# EAGLE design Location_controller (EAGLE 6.5.0)
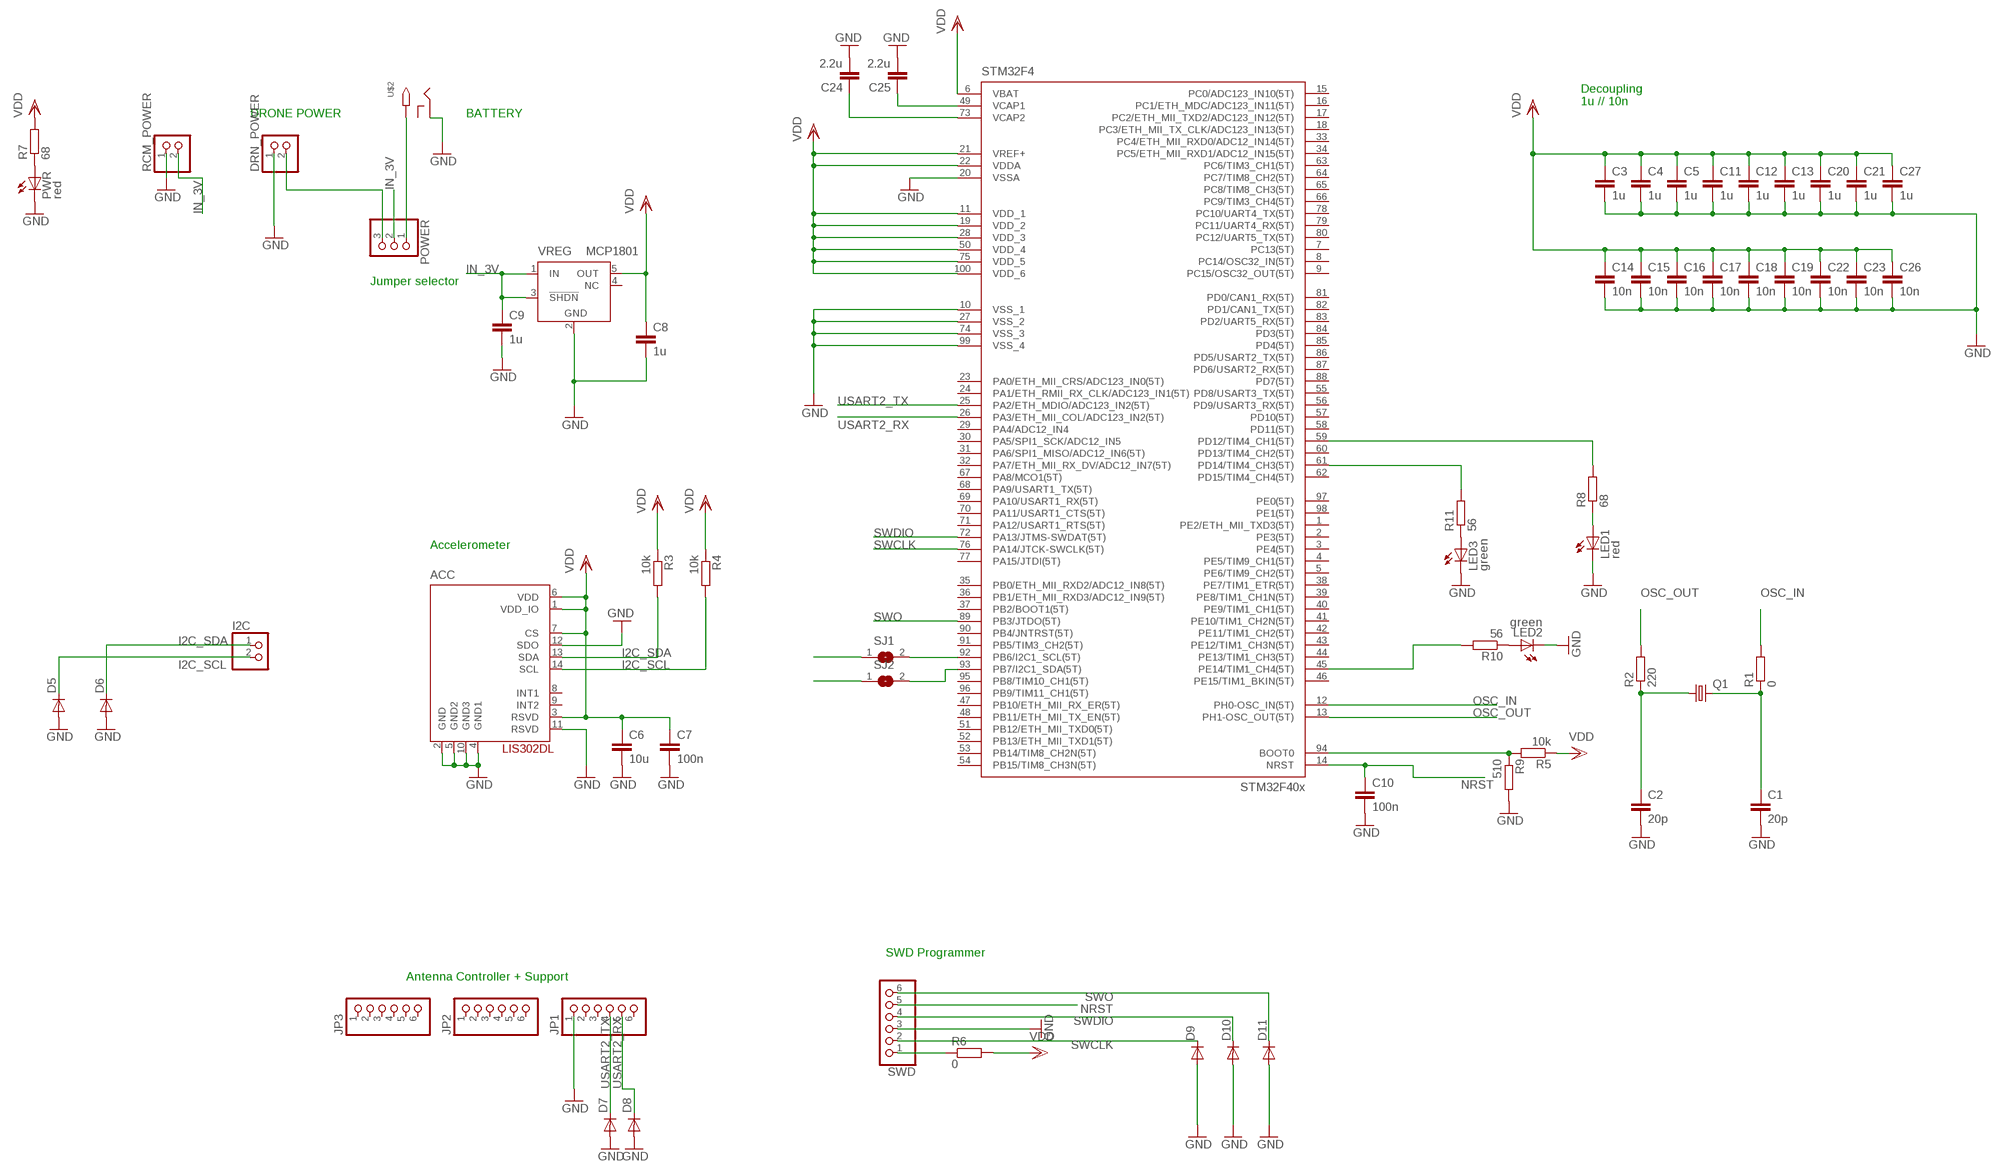
[diagram p0: schematic, sheet 1]

## Parts
ACC  LIS302DL  LSM303DLHC  [LGA-14]
C1  20p  C  [C0805]
C2  20p  C  [C0805]
C3  1u  C  [C0805]
C4  1u  C  [C0805]
C5  1u  C  [C0805]
C6  10u  C  [C0805]
C7  100n  C  [C0805]
C8  1u  C  [C0805]
C9  1u  C  [C0805]
C10  100n  C  [C0805]
C11  1u  C  [C0805]
C12  1u  C  [C0805]
C13  1u  C  [C0805]
C14  10n  C  [C0805]
C15  10n  C  [C0805]
C16  10n  C  [C0805]
C17  10n  C  [C0805]
C18  10n  C  [C0805]
C19  10n  C  [C0805]
C20  1u  C  [C0805]
C21  1u  C  [C0805]
C22  10n  C  [C0805]
C23  10n  C  [C0805]
C24  2.2u  C  [C0805]
C25  2.2u  C  [C0805]
C26  10n  C  [C0805]
C27  1u  C  [C0805]
D5  DIODE-SOD523  [SOD523]
D6  DIODE-SOD523  [SOD523]
D7  DIODE-SOD523  [SOD523]
D8  DIODE-SOD523  [SOD523]
D9  DIODE-SOD523  [SOD523]
D10  DIODE-SOD523  [SOD523]
D11  DIODE-SOD523  [SOD523]
DRN_POWER  PINHD-1X2  [1X02]
I2C  PINHD-1X2  [1X02]
JP1  PINHD-1X6  [1X06]
JP2  PINHD-1X6  [1X06]
JP3  PINHD-1X6  [1X06]
LED1  red  LEDCHIPLED_0805  [CHIPLED_0805]
LED2  green  LEDCHIPLED_0805  [CHIPLED_0805]
LED3  green  LEDCHIPLED_0805  [CHIPLED_0805]
POWER  PINHD-1X3  [1X03]
PWR  red  LEDCHIPLED_0805  [CHIPLED_0805]
Q1  CRYSTALHC49S  [HC49/S]
R1  0  R  [R0805]
R2  220  R  [R0805]
R3  10k  R  [R0805]
R4  10k  R  [R0805]
R5  10k  R  [R0805]
R6  0  R  [R0805]
R7  68  R  [R0805]
R8  68  R  [R0805]
R9  510  R  [R0805]
R10  56  R  [R0805]
R11  56  R  [R0805]
RCM_POWER  PINHD-1X2  [1X02]
SJ1  SJ  [SJ]
SJ2  SJ  [SJ]
STM32F4  STM32F407V  [TQFP100]
SWD  PINHD-1X6  [1X06]
U$2  2.1MMJACKTHM  [PJ-102A]
VREG  MCP1801  [SOT23-5]

## Nets
GND: ACC.2(GND) ACC.4(GND1) ACC.5(GND2) ACC.10(GND3) ACC.11(RSVD) ACC.12(SDO) C1.2 C2.2 C3.2 C4.2 C5.2 C6.2 C7.2 C8.2 C9.2 C10.2 C11.2 C12.2 C13.2 C14.2 C15.2 C16.2 C17.2 C18.2 C19.2 C20.2 C21.2 C22.2 C23.2 C24.2 C25.2 C26.2 C27.2 D5.A D6.A D7.A D8.A D9.A D10.A D11.A DRN_POWER.1 JP1.1 LED1.C LED2.C LED3.C PWR.C R9.2 RCM_POWER.1 STM32F4.10(VSS_1) STM32F4.20(VSSA) STM32F4.27(VSS_2) STM32F4.74(VSS_3) STM32F4.99(VSS_4) SWD.3 U$2.RING VREG.2(GND)
I2C_SCL: ACC.14(SCL) D5.C I2C.2 R4.2 SJ1.1
I2C_SDA: ACC.13(SDA) D6.C I2C.1 R3.2 SJ2.1
IN_3V: C9.1 POWER.2 RCM_POWER.2 VREG.1(IN) VREG.3(!SHDN)
N$1: C2.1 Q1.1 R2.1
N$2: C1.1 Q1.2 R1.1
N$3: R5.2 R9.1 STM32F4.94(BOOT0)
N$4: DRN_POWER.2 POWER.3
N$5: POWER.1 U$2.TIP
N$6: R6.1 SWD.1
N$8: C25.1 STM32F4.49(VCAP1)
N$9: C24.1 STM32F4.73(VCAP2)
N$12: PWR.A R7.1
N$13: LED1.A R8.1
N$14: R8.2 STM32F4.59(PD12/TIM4_CH1(5T))
N$15: LED2.A R10.1
N$16: R10.2 STM32F4.45(PE14/TIM1_CH4(5T))
N$17: LED3.A R11.1
N$18: SJ2.2 STM32F4.93(PB7/I2C1_SDA(5T))
N$19: R11.2 STM32F4.61(PD14/TIM4_CH3(5T))
N$20: SJ1.2 STM32F4.92(PB6/I2C1_SCL(5T))
NRST: C10.1 STM32F4.14(NRST) SWD.5
OSC_IN: R1.2 STM32F4.12(PH0-OSC_IN(5T))
OSC_OUT: R2.2 STM32F4.13(PH1-OSC_OUT(5T))
SWCLK: D9.C STM32F4.76(PA14/JTCK-SWCLK(5T)) SWD.2
SWDIO: D10.C STM32F4.72(PA13/JTMS-SWDAT(5T)) SWD.4
SWO: D11.C STM32F4.89(PB3/JTDO(5T)) SWD.6
USART2_RX: D8.C JP1.5 STM32F4.26(PA3/ETH_MII_COL/ADC123_IN2(5T))
USART2_TX: D7.C JP1.4 STM32F4.25(PA2/ETH_MDIO/ADC123_IN2(5T))
VDD: ACC.1(VDD_IO) ACC.3(RSVD) ACC.6(VDD) ACC.7(CS) C3.1 C4.1 C5.1 C6.1 C7.1 C8.1 C11.1 C12.1 C13.1 C14.1 C15.1 C16.1 C17.1 C18.1 C19.1 C20.1 C21.1 C22.1 C23.1 C26.1 C27.1 R3.1 R4.1 R5.1 R6.2 R7.2 STM32F4.6(VBAT) STM32F4.11(VDD_1) STM32F4.19(VDD_2) STM32F4.21(VREF+) STM32F4.22(VDDA) STM32F4.28(VDD_3) STM32F4.50(VDD_4) STM32F4.75(VDD_5) STM32F4.100(VDD_6) VREG.5(OUT)
Unconnected: ACC.8(INT1) ACC.9(INT2) JP1.2 JP1.3 JP1.6 JP2.1 JP2.2 JP2.3 JP2.4 JP2.5 JP2.6 JP3.1 JP3.2 JP3.3 JP3.4 JP3.5 JP3.6 STM32F4.1(PE2/ETH_MII_TXD3(5T)) STM32F4.2(PE3(5T)) STM32F4.3(PE4(5T)) STM32F4.4(PE5/TIM9_CH1(5T)) STM32F4.5(PE6/TIM9_CH2(5T)) STM32F4.7(PC13(5T)) STM32F4.8(PC14/OSC32_IN(5T)) STM32F4.9(PC15/OSC32_OUT(5T)) STM32F4.15(PC0/ADC123_IN10(5T)) STM32F4.16(PC1/ETH_MDC/ADC123_IN11(5T)) STM32F4.17(PC2/ETH_MII_TXD2/ADC123_IN12(5T)) STM32F4.18(PC3/ETH_MII_TX_CLK/ADC123_IN13(5T)) STM32F4.23(PA0/ETH_MII_CRS/ADC123_IN0(5T)) STM32F4.24(PA1/ETH_RMII_RX_CLK/ADC123_IN1(5T)) STM32F4.29(PA4/ADC12_IN4) STM32F4.30(PA5/SPI1_SCK/ADC12_IN5) STM32F4.31(PA6/SPI1_MISO/ADC12_IN6(5T)) STM32F4.32(PA7/ETH_MII_RX_DV/ADC12_IN7(5T)) STM32F4.33(PC4/ETH_MII_RXD0/ADC12_IN14(5T)) STM32F4.34(PC5/ETH_MII_RXD1/ADC12_IN15(5T)) STM32F4.35(PB0/ETH_MII_RXD2/ADC12_IN8(5T)) STM32F4.36(PB1/ETH_MII_RXD3/ADC12_IN9(5T)) STM32F4.37(PB2/BOOT1(5T)) STM32F4.38(PE7/TIM1_ETR(5T)) STM32F4.39(PE8/TIM1_CH1N(5T)) STM32F4.40(PE9/TIM1_CH1(5T)) STM32F4.41(PE10/TIM1_CH2N(5T)) STM32F4.42(PE11/TIM1_CH2(5T)) STM32F4.43(PE12/TIM1_CH3N(5T)) STM32F4.44(PE13/TIM1_CH3(5T)) STM32F4.46(PE15/TIM1_BKIN(5T)) STM32F4.47(PB10/ETH_MII_RX_ER(5T)) STM32F4.48(PB11/ETH_MII_TX_EN(5T)) STM32F4.51(PB12/ETH_MII_TXD0(5T)) STM32F4.52(PB13/ETH_MII_TXD1(5T)) STM32F4.53(PB14/TIM8_CH2N(5T)) STM32F4.54(PB15/TIM8_CH3N(5T)) STM32F4.55(PD8/USART3_TX(5T)) STM32F4.56(PD9/USART3_RX(5T)) STM32F4.57(PD10(5T)) STM32F4.58(PD11(5T)) STM32F4.60(PD13/TIM4_CH2(5T)) STM32F4.62(PD15/TIM4_CH4(5T)) STM32F4.63(PC6/TIM3_CH1(5T)) STM32F4.64(PC7/TIM8_CH2(5T)) STM32F4.65(PC8/TIM8_CH3(5T)) STM32F4.66(PC9/TIM3_CH4(5T)) STM32F4.67(PA8/MCO1(5T)) STM32F4.68(PA9/USART1_TX(5T)) STM32F4.69(PA10/USART1_RX(5T)) STM32F4.70(PA11/USART1_CTS(5T)) STM32F4.71(PA12/USART1_RTS(5T)) STM32F4.77(PA15/JTDI(5T)) STM32F4.78(PC10/UART4_TX(5T)) STM32F4.79(PC11/UART4_RX(5T)) STM32F4.80(PC12/UART5_TX(5T)) STM32F4.81(PD0/CAN1_RX(5T)) STM32F4.82(PD1/CAN1_TX(5T)) STM32F4.83(PD2/UART5_RX(5T)) STM32F4.84(PD3(5T)) STM32F4.85(PD4(5T)) STM32F4.86(PD5/USART2_TX(5T)) STM32F4.87(PD6/USART2_RX(5T)) STM32F4.88(PD7(5T)) STM32F4.90(PB4/JNTRST(5T)) STM32F4.91(PB5/TIM3_CH2(5T)) STM32F4.95(PB8/TIM10_CH1(5T)) STM32F4.96(PB9/TIM11_CH1(5T)) STM32F4.97(PE0(5T)) STM32F4.98(PE1(5T)) U$2.RING_SW VREG.4(NC)

## Notes on the sheet
- Decoupling
  1u // 10n
- DRONE POWER | BATTERY
- Jumper selector
- Accelerometer
- SWD Programmer
- Antenna Controller + Support

## Library data of the parts
ACC = stm32f4:LSM303DLHC: Ultra compact high performance e-compass, 3D accelerometer and 3D magnetometer module LIS302DL
C1-C27 = eagle-ltspice:C: CAPACITOR, European symbol; SPICEMODEL: NONE; SPICEPREFIX: C
D5-D11 = diode:DIODE-: DIODE
DRN_POWER I2C RCM_POWER = pinhead:PINHD-1X2: PIN HEADER
JP1-JP3 SWD = pinhead:PINHD-1X6: PIN HEADER
LED1-LED3 PWR = led:LED: LED OSRAM: - CHIPLED LG R971, LG N971, LY N971, LG Q971, LY Q971, LO R971, LY R971 LH N974, LH R974 LS Q976, LO Q976, LY Q976 LO Q996 - Hyper CHIPLED LW Q18S LB Q993, LB Q99A, LB R99A - SideLED LS A670, LO A670, LY A670, LG A670, LP A670 LB A673, LV A673, LT A673, LW A673 LH A674 LY A675 LS A676, LA A676, LO A676, LY A676, LW A676 LS A679, LY A679, LG A679 - Hyper Micro SIDELED® LS Y876, LA Y876, LO Y876, LY Y876 LT Y87S - SmartLED LW L88C, LW L88S LB L89C, LB L89S, LG L890 LS L89K, LO L89K, LY L89K LS L896, LA L896, LO L896, LY L896 - TOPLED LS T670, LO T670, LY T670, LG T670, LP T670 LSG T670, LSP T670, LSY T670, LOP T670, LYG T670 LG T671, LOG T671, LSG T671 LB T673, LV T673, LT T673, LW T673 LH T674 LS T676, LA T676, LO T676, LY T676, LB T676, LH T676, LSB T676, LW T676 LB T67C, LV T67C, LT T67C, LS T67K, LO T67K, LY T67K, LW E67C LS E67B, LA E67B, LO E67B, LY E67B, LB E67C, LV E67C, LT E67C LW T67C LS T679, LY T679, LG T679 LS T770, LO T770, LY T770, LG T770, LP T770 LB T773, LV T773, LT T773, LW T773 LH T774 LS E675, LA E675, LY E675, LS T675 LS T776, LA T776, LO T776, LY T776, LB T776 LHGB T686 LT T68C, LB T68C - Hyper Mini TOPLED® LB M676 - Mini TOPLED Santana® LG M470 LS M47K, LO M47K, LY M47K Source: http://www.osram.convergy.de LUXEON: - LUMILED® LXK2-PW12-R00, LXK2-PW12-S00, LXK2-PW14-U00, LXK2-PW14-V00 LXK2-PM12-R00, LXK2-PM12-S00, LXK2-PM14-U00 LXK2-PE12-Q00, LXK2-PE12-R00, LXK2-PE12-S00, LXK2-PE14-T00, LXK2-PE14-U00 LXK2-PB12-K00, LXK2-PB12-L00, LXK2-PB12-M00, LXK2-PB14-N00, LXK2-PB14-P00, LXK2-PB14-Q00 LXK2-PR12-L00, LXK2-PR12-M00, LXK2-PR14-Q00, LXK2-PR14-R00 LXK2-PD12-Q00, LXK2-PD12-R00, LXK2-PD12-S00 LXK2-PH12-R00, LXK2-PH12-S00 LXK2-PL12-P00, LXK2-PL12-Q00, LXK2-PL12-R00 Source: www.luxeon.com KINGBRIGHT: KA-3528ASYC Source: www.kingbright.com
POWER = pinhead:PINHD-1X3: PIN HEADER
Q1 = crystal:CRYSTAL: CRYSTAL; OC_FARNELL: 1667008; OC_NEWARK: unknown
R1-R11 = eagle-ltspice:R: RESISTOR, European symbol; SPICEMODEL: NONE; SPICEPREFIX: R
SJ1 SJ2 = jumper:SJ: SMD solder JUMPER
STM32F4 = stm32f4:STM32F407V: STM32F407 100 pin LQFP reviewed: YES tested: YES
U$2 = adafruit:2.1MMJACK: 2.1mm x 5.5mm THM DC jack with internal switch. Digikey part #PJ-102A, 4UCON part #05537 2.1mm x 5.5mm SMT DC jack with internal switch. Digikey part #PJ-002A-SMT, 4UCON part #03267 By microbuilder.eu & adafruit.com
VREG = stm32f4:MCP1801: MCP1801 150 mA, LDO Voltage Regulator

## Board
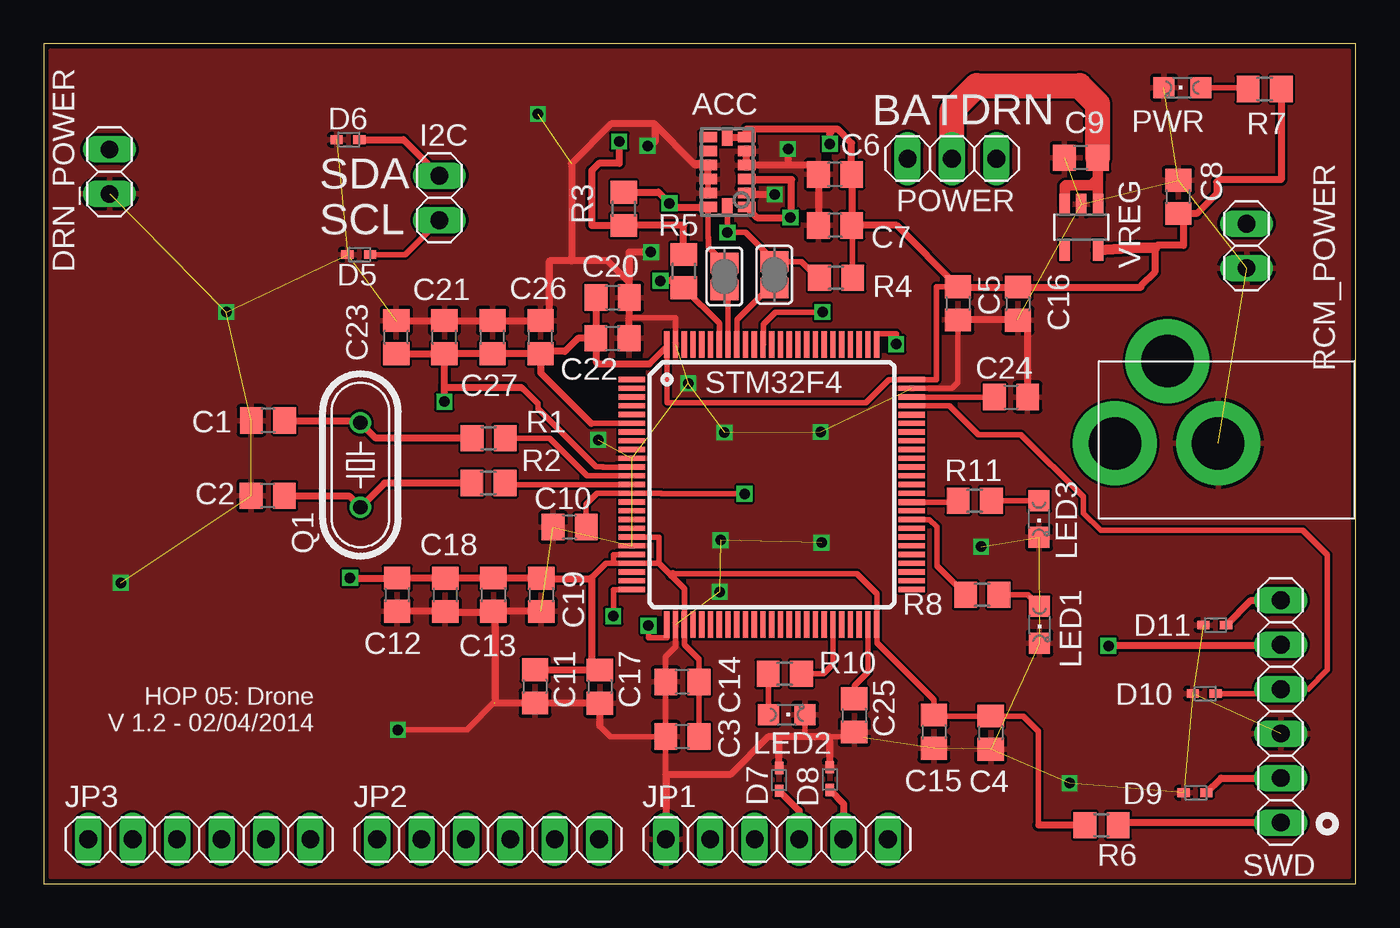
[diagram p1: board, top side]
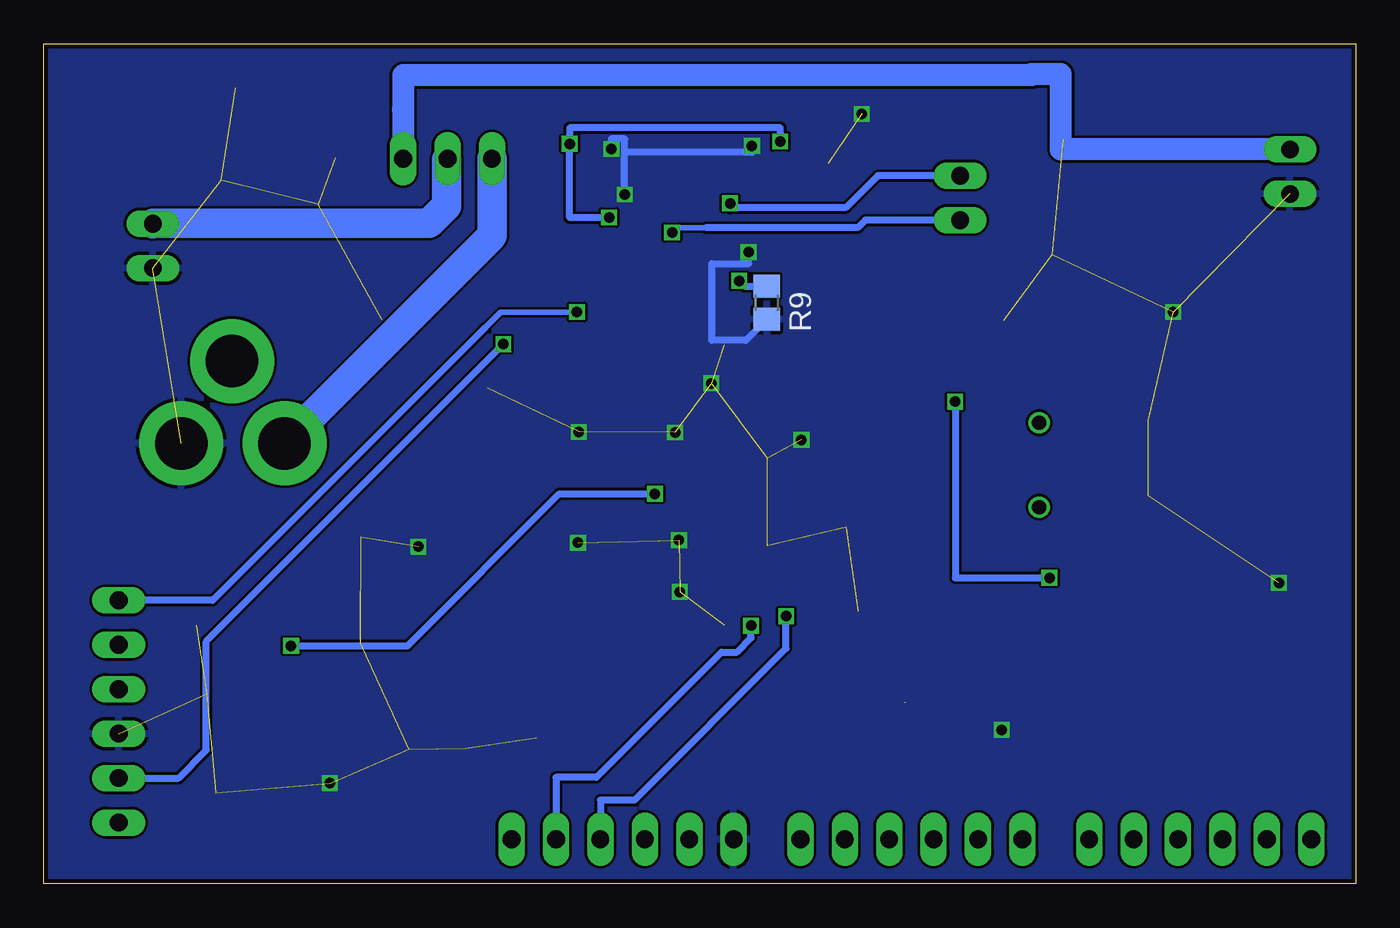
[diagram p2: board, bottom side, seen from below]

Size 75 x 48 mm. Coordinates in mm from the lower left corner, seen from the top.
Outline: 0,0 75,0 75,48 0,48 0,0
Copper layers (1*16): Top 0.018mm / dielectric 1.55mm / Bottom 0.018mm
Design rules "eC_2Layer_PClass6_BaseCopperO18_eCDefault": minimum track width 0.15mm, minimum drill 0.35mm, track to track 0.15mm, track to pad 0.15mm, pad to pad 0.15mm, via to via 0.15mm, smd to smd 0mil, copper to edge 0.25mm, drill to drill 0.35mm, minimum pad ring 0.175mm, minimum via ring 0.125mm, stop-mask expansion 0mil, vias tented up to drill 0.45mm, thermal gap 0.2mm

### Footprints (pad centres in the part's own frame; a part is rotated, then mirrored left to right if it is on the bottom)
LGA-14 = smd 0.6 x 1: 1 -2,-1.1; 2 -1.2,-1.1; 3 -0.4,-1.1; 4 0.4,-1.1; 5 1.2,-1.1; 6 2,-1.1; 8 2,1.1; 9 1.2,1.1; 10 0.4,1.1; 11 -0.4,1.1; 12 -1.2,1.1; 13 -2,1.1 | smd 1 x 0.6: 7 2,0; 14 -2,0
C0805 = smd 1.3 x 1.5: 1 -0.95,0; 2 0.95,0
SOD523 = smd 0.7 x 0.5: A 0.7,0; C -0.6,0
1X02 = drill 1.016 long: 1 -1.27,0; 2 1.27,0
1X06 = drill 1.016 long: 1 -6.35,0; 2 -3.81,0; 3 -1.27,0; 4 1.27,0; 5 3.81,0; 6 6.35,0
CHIPLED_0805 = smd 1.2 x 1.2: A 0,-1.05; C 0,1.05
1X03 = drill 1.016 long: 1 -2.54,0; 2 0,0; 3 2.54,0
HC49/S = drill 0.813: 1 -2.413,0; 2 2.413,0
R0805 = smd 1.3 x 1.5: 1 -0.95,0; 2 0.95,0
SJ = smd 1.168 x 1.6: 1 -0.762,0; 2 0.762,0
TQFP100 = smd 1.5 x 0.3: 1 -8,6; 2 -8,5.5; 3 -8,5; 4 -8,4.5; 5 -8,4; 6 -8,3.5; 7 -8,3; 8 -8,2.5; 9 -8,2; 10 -8,1.5; 11 -8,1; 12 -8,0.5; 13 -8,0; 14 -8,-0.5; 15 -8,-1; 16 -8,-1.5; 17 -8,-2; 18 -8,-2.5; 19 -8,-3; 20 -8,-3.5; 21 -8,-4; 22 -8,-4.5; 23 -8,-5; 24 -8,-5.5; 25 -8,-6; 51 8,-6; 52 8,-5.5; 53 8,-5; 54 8,-4.5; 55 8,-4; 56 8,-3.5; 57 8,-3; 58 8,-2.5; 59 8,-2; 60 8,-1.5; 62 8,-0.5; 63 8,0; 64 8,0.5; 65 8,1; 66 8,1.5; 67 8,2; 68 8,2.5; 69 8,3; 70 8,3.5; 72 8,4.5; 73 8,5; 74 8,5.5; 75 8,6 | smd 0.3 x 1.5: 26 -6,-8; 27 -5.5,-8; 28 -5,-8; 29 -4.5,-8; 30 -4,-8; 31 -3.5,-8; 32 -3,-8; 33 -2.5,-8; 34 -2,-8; 35 -1.5,-8; 36 -1,-8; 37 -0.5,-8; 38 0,-8; 39 0.5,-8; 40 1,-8; 41 1.5,-8; 42 2,-8; 43 2.5,-8; 44 3,-8; 45 3.5,-8; 46 4,-8; 47 4.5,-8; 48 5,-8; 49 5.5,-8; 50 6,-8; 76 6,8; 77 5.5,8; 78 5,8; 79 4.5,8; 80 4,8; 81 3.5,8; 82 3,8; 83 2.5,8; 84 2,8; 85 1.5,8; 86 1,8; 87 0.5,8; 88 0,8; 89 -0.5,8; 90 -1,8; 91 -1.5,8; 92 -2,8; 93 -2.5,8; 94 -3,8; 95 -3.5,8; 96 -4,8; 97 -4.5,8; 98 -5,8; 99 -5.5,8; 100 -6,8 | smd 1.5 x 0.35: 61 8,-1; 71 8,4
PJ-102A = drill 3 pad 4.8: RING 0.1,-3.39; RING_SW -4.6,-6.29; TIP 0.1,-9.29
SOT23-5 = smd 0.6 x 1.2: 1 -0.95,-1.306; 2 0,-1.306; 3 0.95,-1.306; 4 0.95,1.306; 5 -0.95,1.306

### Placement (x,y rotation side)
ACC  39.08,40.67 90 top
C1  12.82,26.47 180 top
C2  12.8,22.17 180 top
C3  36.5,8.41 180 top
C4  54.13,8.63 270 top
C5  52.26,33.17 270 top
C6  45.23,40.53 180 top
C7  45.24,37.62 180 top
C8  64.85,39.25 90 top
C9  59.29,41.49 180 top
C10  30.06,20.38 180 top
C11  28.08,11.28 270 top
C12  20.2,16.52 270 top
C13  25.7,16.52 270 top
C14  36.5,11.53 180 top
C15  50.89,8.69 270 top
C16  55.68,33.15 270 top
C17  31.79,11.27 270 top
C18  22.95,16.51 270 top
C19  28.44,16.51 270 top
C20  32.52,33.5 0 top
C21  22.9,31.23 90 top
C22  32.51,31.17 0 top
C23  20.15,31.23 90 top
C24  55.29,27.81 0 top
C25  46.33,9.62 270 top
C26  28.4,31.23 90 top
C27  25.65,31.23 90 top
D5  18.06,35.95 180 top
D6  17.44,42.52 180 top
D7  42.04,5.92 90 top
D8  44.93,5.96 90 top
D9  65.86,5.2 180 top
D10  66.39,10.87 180 top
D11  66.99,14.78 180 top
DRN_POWER  3.76,40.69 90 top
I2C  22.62,39.19 270 top
JP1  41.91,2.54 0 top
JP2  25.4,2.54 0 top
JP3  8.89,2.54 0 top
LED1  56.92,14.8 180 top
LED2  42.47,9.66 270 top
LED3  56.89,20.85 180 top
POWER  51.92,41.43 0 top
PWR  65.08,45.49 90 top
Q1  18.1,23.93 90 top
R1  25.43,25.46 0 top
R2  25.42,22.9 0 top
R3  33.16,38.57 90 top
R4  45.29,34.63 180 top
R5  36.58,35.01 270 top
R6  60.46,3.35 180 top
R7  69.79,45.42 0 top
R8  53.65,16.52 180 top
R9  33.67,33.2 270 bottom
R10  42.36,12 0 top
R11  53.22,21.89 180 top
RCM_POWER  68.76,36.45 90 top
SJ1  41.76,34.8 270 top
SJ2  38.91,34.7 270 top
STM32F4  41.62,22.81 0 top
SWD  70.71,9.85 90 top
U$2  70.52,25.27 270 top
VREG  59.31,37.52 180 top

### Tracks (layer width: path | path; a pad name or v marks a point on that pad's centre or on a via)
GND  (via drill 0.6)  (37 unrouted)
  Top 0.305: STM32F4.27 36.12,13.54 35.55,12.97 C14.2 C3.2 | STM32F4.74 51.9,28.31 52.26,28.67 C5.2 | STM32F4.99 36.12,32.35 33.46,32.35 | v20.24,8.8 24.19,8.8 25.81,10.42 25.81,10.41 25.75,10.35 | C25.2 46.05,8.39 44.57,8.39 | LED2.C 43.52,8.39 44.07,8.39 | C3.2 32.39,8.41 31.79,9.01 | C3.2 35.55,6.24 35.56,6.23 | ACC.12 ACC.11
  Top 0.406: C13.2 25.7,15.51 22.99,15.51 22.99,15.56 C18.2 C12.2 19.98,15.79 | C23.2 C21.2 C27.2 C26.2 28.89,32.67 28.89,35.57 28.92,35.6 30.17,35.6 | C20.2 33.47,36.09 v34.71,36.09 | C20.2 33.46,32.35 C22.2 | C20.2 33.46,34.36 32.22,35.6 30.17,35.6 | C7.2 C6.2 44.28,41.07 42.55,41.07 | ACC.5 ACC.4 42.55,41.07 | C5.2 55.66,32.22 C16.2 56.24,31.64 C24.2 | 46.85,8.33 C25.2 | 31.79,9.01 C17.2 C11.2 25.79,10.34 25.79,15.56 | 42.02,8.39 44.07,8.39 44.57,8.39 44.93,8.39 D8.A | 42.02,8.39 41.41,8.39 39.25,6.23 35.56,6.23 JP1.1 | ACC.11 ACC.10 | ACC.10 37.98,41.15 37.18,41.15 34.91,43.42 32.44,43.42 30.17,41.15 30.17,35.6 | C13.2 25.79,15.56 | C19.2 25.79,15.56 | C13.2 | ACC.10 37.24,41.07 34.93,43.38 34.93,42.39 34.52,42.39 v34.52,42.17 | v42.55,41.98 42.55,41.07 | ACC.2 40.18,39.39 v41.79,39.39 | D7.A 42.04,8.37 42.02,8.39
  Bottom 0.406: v34.71,36.09 34.71,35.44 36.81,35.44 36.81,31.05 34.87,31.05 R9.2 | v42.55,41.98 v42.56,41.98 42.56,42.56 41.79,42.56 41.79,41.79 | v41.79,39.39 41.79,41.79 | 34.52,41.79 41.79,41.79 | 34.5,41.79 34.52,41.79 | 34.52,41.79 v34.52,42.17
  other vias: 31.69,25.37 10.43,32.67 28.24,43.99 58.64,5.75 4.4,17.2 53.58,19.26 36.84,28.6 44.41,25.82 38.64,16.68 44.46,19.49 38.91,25.79 38.69,19.63
  pour Bottom: 0.35,47.7 74.7,47.7 74.7,0.24 0.35,0.24
  pour Top: 0.4,47.57 74.61,47.57 74.61,0.42 0.4,0.42 0.4,47.56
I2C_SCL  (via drill 0.6)
  Top 0.305: D5.C 20.65,35.95 I2C.2 | ACC.14 v39.08,37.22 40.1,37.22 SJ1.1 41.78,35.54 43.32,35.54 44.23,34.63 R4.2
  Bottom 0.305: 37.14,37.49 39.08,37.49 v39.08,37.22
  Bottom 0.406: I2C.2 28.04,37.92 28.47,37.49 37.14,37.49
I2C_SDA  (via drill 0.6)
  Top 0.305: SJ2.1 37.99,36.38 37.99,36.91 37.98,36.92 ACC.13
  Top 0.406: 38.1,38.55 ACC.13 35.98,38.67 v35.77,38.88 35.13,39.52 R3.2 | D6.C 20.56,42.52 I2C.1
  Bottom 0.406: 35.77,38.61 v35.77,38.88 35.52,38.63 29.15,38.63 27.32,40.46 I2C.1
IN_3V
  Top 0.61: VREG.1 60.26,40.28 | 60.26,40.28 60.26,41.47 C9.1 | VREG.3 58.36,39.85 58.42,39.91 59.89,39.91 60.26,40.28
  Top 1.422: POWER.2 51.92,44.2 53.32,45.6 59.2,45.6 60.24,44.56 C9.1
  Bottom 0.406: 51.97,41.38 POWER.2
  Bottom 1.676: 51.97,41.38 51.97,38.71 52,38.71 52.98,37.73 RCM_POWER.2
N$1
  Top 0.406: C2.1 17.45,22.17 Q1.1 19.48,22.9 R2.1
N$2
  Top 0.406: C1.1 17.97,26.47 Q1.2 18.98,25.46 R1.1
N$3  (via drill 0.6)
  Top 0.305: R5.2 38.62,32.02 STM32F4.94
  Top 0.406: R5.2 36.19,34.45 v35.25,34.45
  Bottom 0.406: v35.25,34.45 34.95,34.15 R9.1
N$4
  Bottom 0.406: 18.52,46.27 18.52,46.21 | 54.45,44.23 54.46,44.23
  Bottom 1.27: 54.46,44.23 POWER.3 | DRN_POWER.2 16.87,41.96 16.87,46.27 18.52,46.27 | 18.52,46.21 54.45,46.21 54.45,44.23
N$5
  Bottom 1.676: POWER.1 49.38,37.02 U$2.TIP
N$6
  Top 0.406: SWD.1 61.41,3.5 R6.1
N$8
  Top 0.305: STM32F4.49 47.12,12.1 46.33,11.31 C25.1
N$9
  Top 0.305: C24.1 STM32F4.73
N$12
  Top 0.305: R7.1 68.77,45.49 PWR.A
N$13
  Top 0.305: R8.1 56.25,16.52 LED1.A
N$14
  Top 0.305: STM32F4.59 50.63,20.81 51.05,20.39 51.05,18.17 R8.2
N$15
  Top 0.305: LED2.A R10.1
N$16
  Top 0.305: R10.2 44.57,12 45.12,12.55 STM32F4.45
N$17
  Top 0.305: R11.1 LED3.A
N$18
  Top 0.305: SJ2.2 39.12,33.73 STM32F4.93
N$19
  Top 0.305: STM32F4.61 52.19,21.81 R11.2
N$20
  Top 0.305: STM32F4.92 39.62,32.23 41.43,34.04 SJ1.2
NRST  (via drill 0.6)
  Top 0.305: C10.1 31.01,21.7 31.62,22.31 STM32F4.14 35.28,22.31 35.31,22.28 v40.06,22.28
  Top 0.406: SWD.5 70.65,13.6 v60.86,13.6
  Bottom 0.406: v60.86,13.6 54.21,13.6 45.53,22.28 v40.06,22.28
OSC_IN
  Top 0.305: STM32F4.12 31.05,23.31 28.9,25.46 R1.2
OSC_OUT
  Top 0.305: STM32F4.13 26.46,22.81 R2.2
SWCLK  (via drill 0.6)
  Top 0.305: v48.73,30.83 48.73,31.42 47.62,31.42 STM32F4.76
  Top 0.406: D9.C 67.3,6.04 SWD.2
  Bottom 0.406: SWD.2 67.3,6.04 65.71,7.63 65.71,13.85 v48.73,30.83
SWDIO
  Top 0.305: STM32F4.72 51.78,27.31 53.42,25.67 55.87,25.67 59.43,22.11 59.43,21.18 60.42,20.19 71.98,20.19 73.38,18.79 73.38,12.22 72.28,11.12 SWD.4 70.46,10.87 D10.C
SWO  (via drill 0.6)
  Top 0.305: STM32F4.89 41.13,31.98 41.82,32.67 v44.52,32.67
  Top 0.406: D11.C 69.01,16.2 SWD.6
  Bottom 0.305: 49.8,31.75 48.88,32.67 v44.52,32.67
  Bottom 0.406: SWD.6 65.35,16.2 49.8,31.75
USART2_RX  (via drill 0.6)
  Top 0.305: STM32F4.26 35.62,14.05 34.57,14.05 v34.57,14.75
  Top 0.406: D8.C 45.72,4.57 JP1.5
  Bottom 0.406: v34.57,14.75 34.57,14.05 35.38,13.24 36.25,13.24 43.41,6.08 45.72,6.08 JP1.5
USART2_TX  (via drill 0.6)
  Top 0.305: v32.56,15.29 32.56,16.81 STM32F4.25
  Top 0.406: D7.C 43.18,4.18 JP1.4
  Bottom 0.406: v32.56,15.29 32.56,13.45 41.23,4.78 43.18,4.78 JP1.4
VDD  (via drill 0.6)
  Top 0.305: 31.29,26.31 STM32F4.6 | STM32F4.11 31.97,23.81 31.97,23.84 31.56,23.84 28.26,27.14 28.26,27.42 27.34,28.34 | 31.34,17.52 32.14,18.31 STM32F4.22 | STM32F4.19 35.17,19.81 35.17,18.31 | 35.17,18.31 STM32F4.22 | 34.6,29.69 35.62,30.71 STM32F4.100 35.64,30.79 35.64,27.52 35.67,27.49 47,27.49 48.32,28.81 STM32F4.75 51.03,28.81 51.03,34.12 C5.1 | 35.17,18.31 35.86,17.62 36.62,16.86 STM32F4.28 36.62,13.65 37.45,12.82 C14.1 C3.1 | 35.96,17.72 46.48,17.72 47.62,16.58 STM32F4.50 47.62,13.78 50.89,10.51 C15.1 50.95,9.58 C4.1 56,9.58 56.86,8.72 56.86,3.35 | STM32F4.22 32.58,18.31 32.58,18.81 STM32F4.21 | C7.1 46.24,37.57 R4.1
  Top 0.406: C26.1 C27.1 C21.1 | C26.1 28.4,29.2 31.29,26.31 | C23.1 C21.1 | C21.1 22.92,30.29 | C21.1 22.9,28.48 22.89,28.47 22.89,28.34 | C11.1 C17.1 31.34,12.22 31.34,17.52 31.27,17.44 28.46,17.44 C19.1 C13.1 C18.1 C12.1 v17.51,17.47 v17.51,17.48 | C20.1 C22.1 | 34.6,29.69 31.68,29.69 31.6,29.77 31.6,31.13 C22.1 | C22.1 30.54,31.17 29.79,30.42 28.54,30.42 C26.1 | 35.96,17.72 35.86,17.62 | 45.18,43.14 40.18,43.14 ACC.6 ACC.7 39.03,42.67 | 45.18,43.14 45.36,43.14 46.18,42.32 C6.1 C7.1 48.76,37.62 C5.1 52.28,34.1 C16.1 62.72,34.1 62.72,34.16 63.51,34.95 63.51,36.35 63.64,36.48 65.15,36.48 65.15,38 C8.1 65.91,38.3 67.05,39.44 67.05,40.1 67.19,40.24 70.74,40.24 R7.2 | ACC.3 40.21,40.24 42.76,40.24 | 22.89,28.34 v22.89,27.55 v22.9,27.55 | 27.34,28.34 22.89,28.34 | ACC.3 40.18,40.34 | ACC.3 40.18,40.25 42.72,40.25 42.72,38.07 v42.68,38.07 40.78,38.07 ACC.1 | v44.94,42.28 44.94,42.9 45.18,43.14 | v32.9,42.42 32.9,41.16 31.73,41.16 31.32,40.75 31.32,37.62 R3.1 36.58,37.62 R5.1 | R6.2 56.86,3.35
  Top 0.61: VREG.5 62.48,36.35 63.51,36.35 | C16.1
  Bottom 0.406: v22.9,27.55 22.9,17.48 v17.51,17.48 | v42.68,38.07 44.94,38.07 v44.94,42.28 44.94,43.19 32.89,43.19 v32.89,42.42 v32.9,42.42

### Text on the board
tNames: BAT | DRN | SDA | SCL | HOP 05: Drone / V 1.2 - 02/04/2014